# Altium schematic sheet 15_eMMC_FLASH.SchDoc
size A3; SheetNumber: 16; SheetTotal: 22
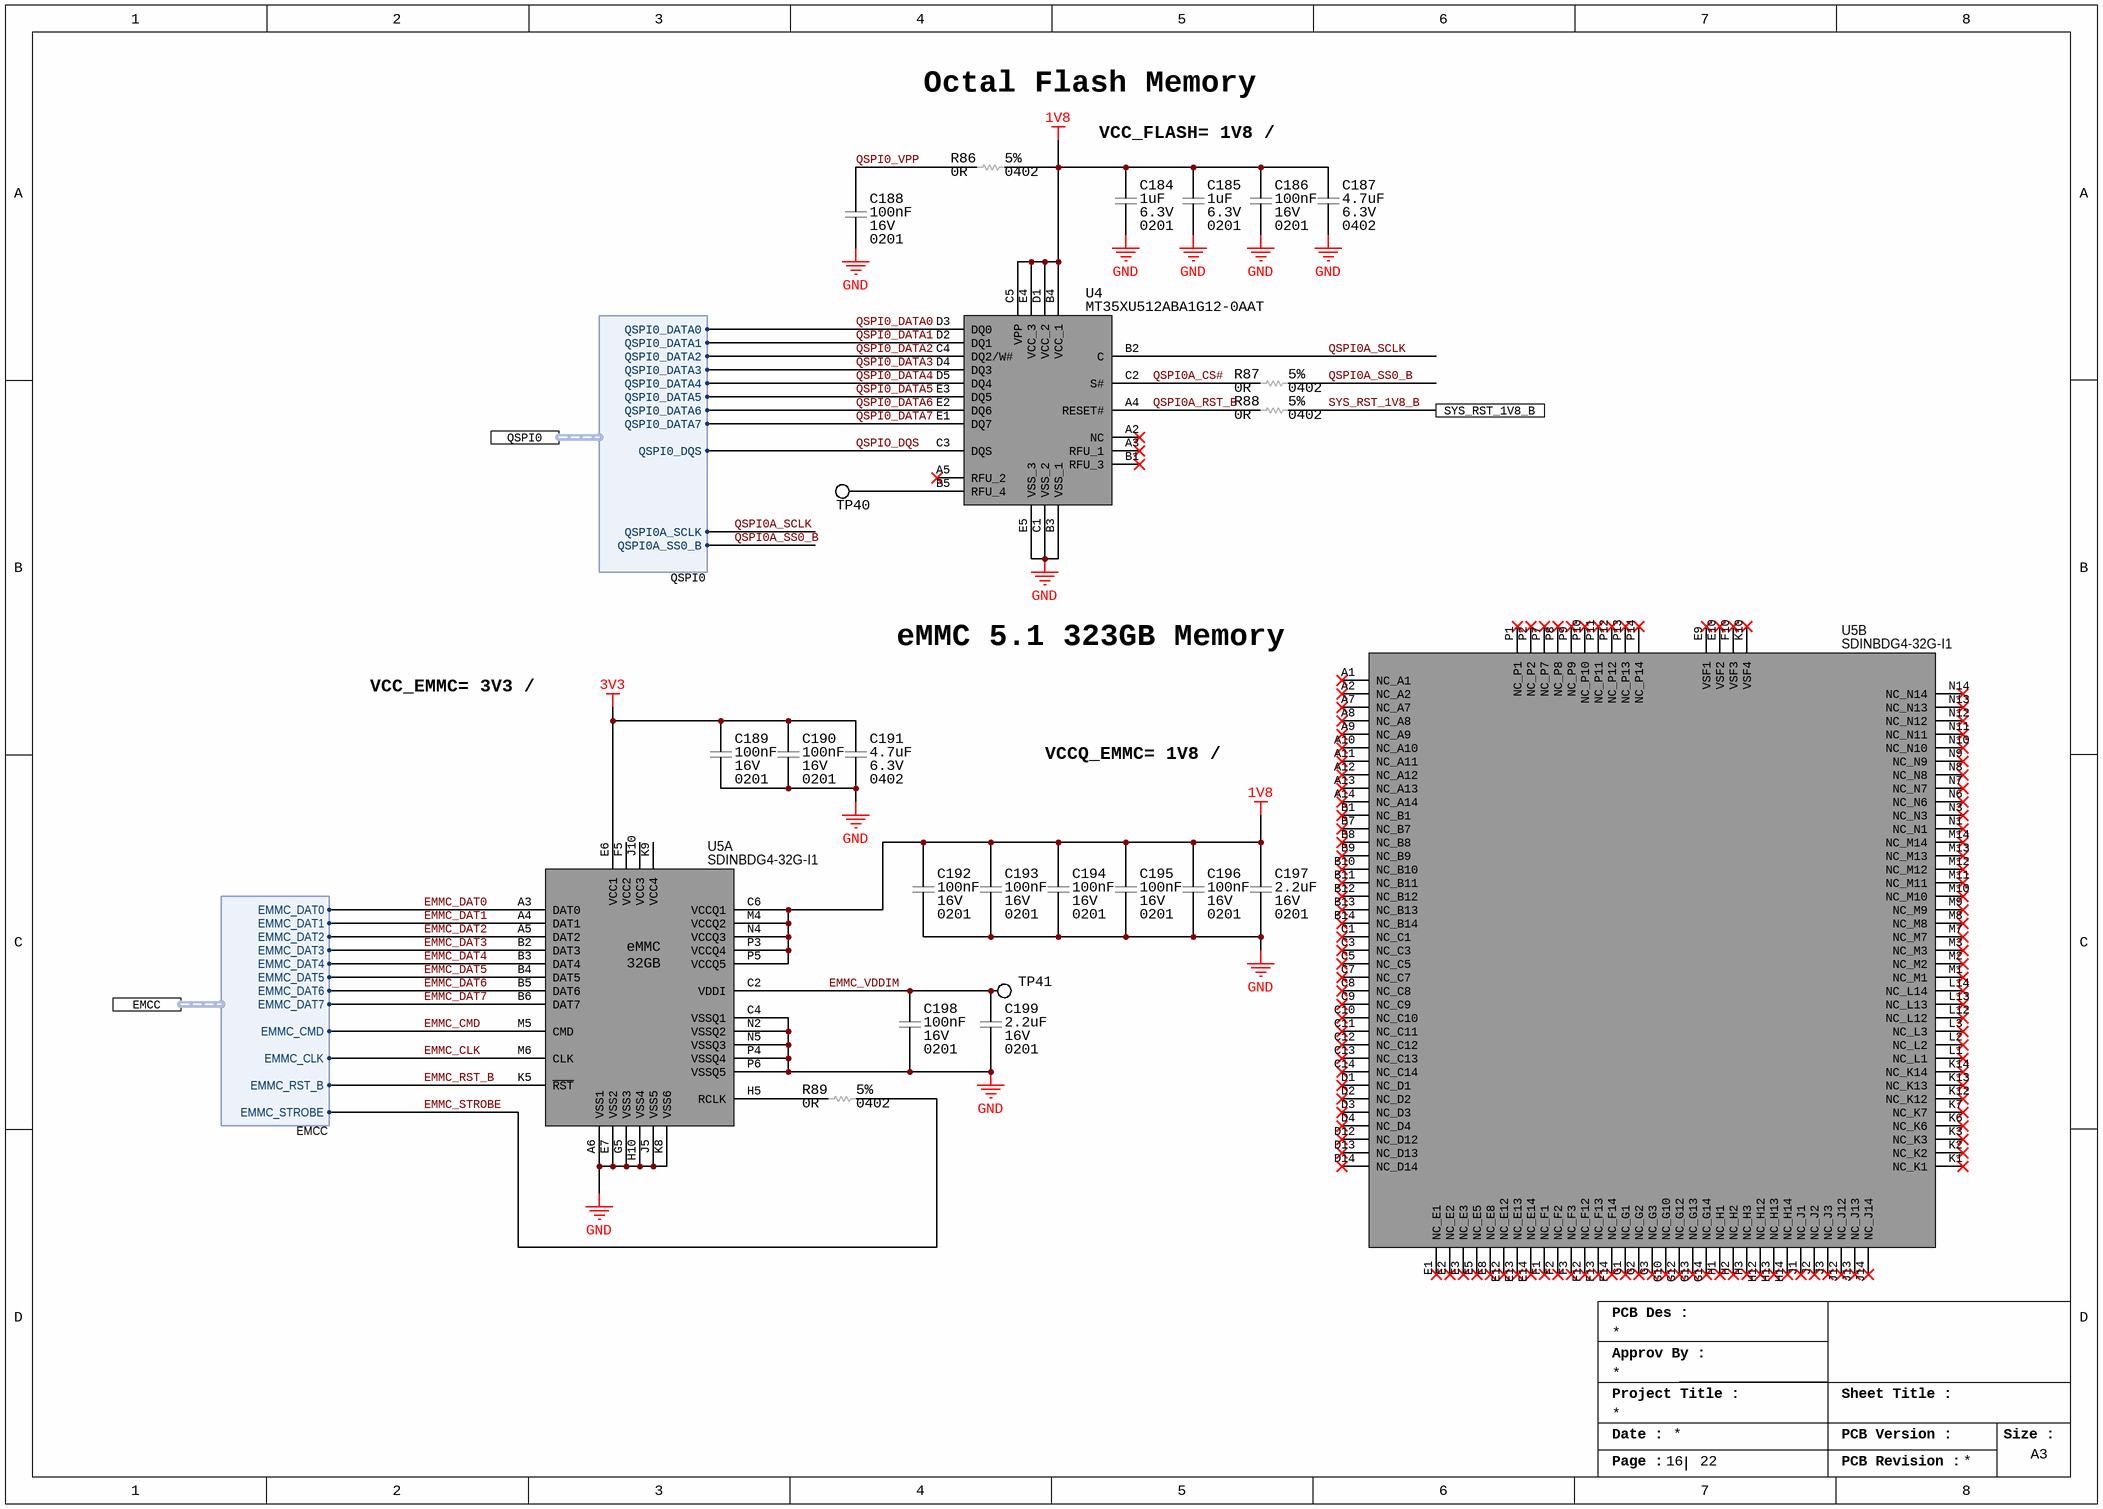
[diagram p0: 15_eMMC_FLASH.SchDoc]

## Parts
C184  Voltage Rating (DC): 6.3V  Capacitance: 1uF  Case/Package: 0201  [CAP_0201_CAPC0603X03N]  (hidden comment: 02016D105MAT2A)
C185  Voltage Rating (DC): 6.3V  Capacitance: 1uF  Case/Package: 0201  [CAP_0201_CAPC0603X03N]  (hidden comment: 02016D105MAT2A)
C186  Voltage Rating: 16V  Capacitance: 100nF  Case/Package: 0201  [CAP_0201_CAPC0603X03N]  (hidden comment: GRM033C71C104KE14D)
C187  Capacitance: 4.7uF  Voltage Rating: 6.3V  Case/Package: 0402  [CAP_0402_CAPC1005X05N]  (hidden comment: C1005X5R0J475M050BC)
C188  Voltage Rating: 16V  Capacitance: 100nF  Case/Package: 0201  [CAP_0201_CAPC0603X03N]  (hidden comment: GRM033C71C104KE14D)
C189  Voltage Rating: 16V  Capacitance: 100nF  Case/Package: 0201  [CAP_0201_CAPC0603X03N]  (hidden comment: GRM033C71C104KE14D)
C190  Voltage Rating: 16V  Capacitance: 100nF  Case/Package: 0201  [CAP_0201_CAPC0603X03N]  (hidden comment: GRM033C71C104KE14D)
C191  Capacitance: 4.7uF  Voltage Rating: 6.3V  Case/Package: 0402  [CAP_0402_CAPC1005X05N]  (hidden comment: C1005X5R0J475M050BC)
C192  Voltage Rating: 16V  Capacitance: 100nF  Case/Package: 0201  [CAP_0201_CAPC0603X03N]  (hidden comment: GRM033C71C104KE14D)
C193  Voltage Rating: 16V  Capacitance: 100nF  Case/Package: 0201  [CAP_0201_CAPC0603X03N]  (hidden comment: GRM033C71C104KE14D)
C194  Voltage Rating: 16V  Capacitance: 100nF  Case/Package: 0201  [CAP_0201_CAPC0603X03N]  (hidden comment: GRM033C71C104KE14D)
C195  Voltage Rating: 16V  Capacitance: 100nF  Case/Package: 0201  [CAP_0201_CAPC0603X03N]  (hidden comment: GRM033C71C104KE14D)
C196  Voltage Rating: 16V  Capacitance: 100nF  Case/Package: 0201  [CAP_0201_CAPC0603X03N]  (hidden comment: GRM033C71C104KE14D)
C197  Capacitance: 2.2uF  Voltage Rating: 16V  Case/Package: 0201  [CAP_0201_CAPC0603X03N]  (hidden comment: GRM035R61C225ME01D)
C198  Voltage Rating: 16V  Capacitance: 100nF  Case/Package: 0201  [CAP_0201_CAPC0603X03N]  (hidden comment: GRM033C71C104KE14D)
C199  Capacitance: 2.2uF  Voltage Rating: 16V  Case/Package: 0201  [CAP_0201_CAPC0603X03N]  (hidden comment: GRM035R61C225ME01D)
R86  Case Code (Imperial): 0402  Tolerance: 5%  Resistance: 0R  [RES_0402_RESC1005X04N]  (hidden comment: ERJ-2GE0R00X)
R87  Case Code (Imperial): 0402  Tolerance: 5%  Resistance: 0R  [RES_0402_RESC1005X04N]  (hidden comment: ERJ-2GE0R00X)
R88  Case Code (Imperial): 0402  Tolerance: 5%  Resistance: 0R  [RES_0402_RESC1005X04N]  (hidden comment: ERJ-2GE0R00X)
R89  Case Code (Imperial): 0402  Tolerance: 5%  Resistance: 0R  [RES_0402_RESC1005X04N]  (hidden comment: ERJ-2GE0R00X)
TP40  NO COMPONENT  [TP_PAD_0.5MM_SMD_ROUND]  (value not drawn)  (no BOM)
TP41  NO COMPONENT  [TP_PAD_0.5MM_SMD_ROUND]  (value not drawn)  (no BOM)
U4  MT35XU512ABA1G12-0AAT  [BGA24C100P5X5_600X800X120]
U5  SDINBDG4-32G-I1  [IC_MEMORY_eMMC]  (parts A,B of 2)

## Ports
EMCC (harness EMCC), QSPI0 (harness QSPI0), SYS_RST_1V8_B

## Harnesses
QSPI0: QSPI0A_SS0_B, QSPI0A_SCLK, QSPI0_DQS, QSPI0_DATA0, QSPI0_DATA1, QSPI0_DATA2, QSPI0_DATA3, QSPI0_DATA4, QSPI0_DATA5, QSPI0_DATA6, QSPI0_DATA7
EMCC: EMMC_CLK, EMMC_CMD, EMMC_DAT0, EMMC_DAT1, EMMC_DAT2, EMMC_DAT3, EMMC_DAT4, EMMC_DAT5, EMMC_DAT6, EMMC_DAT7, EMMC_STROBE, EMMC_RST_B

## Nets
1V8: C184.2 C185.2 C186.2 C187.2 C192.2 C193.2 C194.2 C195.2 C196.2 C197.2 R86.2 U4.B4(VCC_1) U4.C5(VPP) U4.D1(VCC_2) U4.E4(VCC_3) U5.C6(VCCQ1) U5.M4(VCCQ2) U5.N4(VCCQ3) U5.P3(VCCQ4) U5.P5(VCCQ5)
3V3: C189.2 C190.2 C191.2 U5.E6(VCC1)
GND: C184.1 C185.1 C186.1 C187.1 C188.1 C189.1 C190.1 C191.1 C192.1 C193.1 C194.1 C195.1 C196.1 C197.1 C198.1 C199.1 U4.B3(VSS_1) U4.C1(VSS_2) U4.E5(VSS_3) U5.A6(VSS1) U5.C4(VSSQ1) U5.E7(VSS2) U5.G5(VSS3) U5.H10(VSS4) U5.J5(VSS5) U5.K8(VSS6) U5.N2(VSSQ2) U5.N5(VSSQ3) U5.P4(VSSQ4) U5.P6(VSSQ5)
EMMC_CLK: U5.M6(CLK) ; port EMCC.EMMC_CLK
EMMC_CMD: U5.M5(CMD) ; port EMCC.EMMC_CMD
EMMC_DAT0: U5.A3(DAT0) ; port EMCC.EMMC_DAT0
EMMC_DAT1: U5.A4(DAT1) ; port EMCC.EMMC_DAT1
EMMC_DAT2: U5.A5(DAT2) ; port EMCC.EMMC_DAT2
EMMC_DAT3: U5.B2(DAT3) ; port EMCC.EMMC_DAT3
EMMC_DAT4: U5.B3(DAT4) ; port EMCC.EMMC_DAT4
EMMC_DAT5: U5.B4(DAT5) ; port EMCC.EMMC_DAT5
EMMC_DAT6: U5.B5(DAT6) ; port EMCC.EMMC_DAT6
EMMC_DAT7: U5.B6(DAT7) ; port EMCC.EMMC_DAT7
EMMC_RST_B: U5.K5(~{RST}) ; port EMCC.EMMC_RST_B
EMMC_STROBE: R89.2 ; port EMCC.EMMC_STROBE
EMMC_VDDIM: C198.2 C199.2 TP41.1 U5.C2(VDDI)
QSPI0_DATA0: U4.D3(DQ0) ; port QSPI0.QSPI0_DATA0
QSPI0_DATA1: U4.D2(DQ1) ; port QSPI0.QSPI0_DATA1
QSPI0_DATA2: U4.C4(DQ2/W#) ; port QSPI0.QSPI0_DATA2
QSPI0_DATA3: U4.D4(DQ3) ; port QSPI0.QSPI0_DATA3
QSPI0_DATA4: U4.D5(DQ4) ; port QSPI0.QSPI0_DATA4
QSPI0_DATA5: U4.E3(DQ5) ; port QSPI0.QSPI0_DATA5
QSPI0_DATA6: U4.E2(DQ6) ; port QSPI0.QSPI0_DATA6
QSPI0_DATA7: U4.E1(DQ7) ; port QSPI0.QSPI0_DATA7
QSPI0_VPP: C188.2 R86.1
QSPI0A_CS#: R87.1 U4.C2(S#)
QSPI0A_RST_B: R88.1 U4.A4(RESET#)
QSPI0A_SCLK: U4.B2(C) ; port QSPI0.QSPI0A_SCLK
QSPI0A_SS0_B: R87.2 ; port QSPI0.QSPI0A_SS0_B
QSPIO_DQS: U4.C3(DQS) ; port QSPI0.QSPI0_DQS
SYS_RST_1V8_B: R88.2 ; port SYS_RST_1V8_B
NetR89_1: R89.1 U5.H5(RCLK)
NetTP40_1: TP40.1 U4.B5(RFU_4)

Not connected (* = marked no-connect by the designer): U4 A2(NC)* A3(RFU_1)* A5(RFU_2)* B1(RFU_3)*; U5 A1(NC_A1)* A2(NC_A2)* A7(NC_A7)* A8(NC_A8)* A9(NC_A9)* A10(NC_A10)* A11(NC_A11)* A12(NC_A12)* A13(NC_A13)* A14(NC_A14)* B1(NC_B1)* B7(NC_B7)* B8(NC_B8)* B9(NC_B9)* B10(NC_B10)* B11(NC_B11)* B12(NC_B12)* B13(NC_B13)* B14(NC_B14)* C1(NC_C1)* C3(NC_C3)* C5(NC_C5)* C7(NC_C7)* C8(NC_C8)* C9(NC_C9)* C10(NC_C10)* C11(NC_C11)* C12(NC_C12)* C13(NC_C13)* C14(NC_C14)* D1(NC_D1)* D2(NC_D2)* D3(NC_D3)* D4(NC_D4)* D12(NC_D12)* D13(NC_D13)* D14(NC_D14)* E1(NC_E1)* E2(NC_E2)* E3(NC_E3)* E5(NC_E5)* E8(NC_E8)* E9(VSF1)* E10(VSF2)* E12(NC_E12)* E13(NC_E13)* E14(NC_E14)* F1(NC_F1)* F2(NC_F2)* F3(NC_F3)* F5(VCC2) F10(VSF3)* F12(NC_F12)* F13(NC_F13)* F14(NC_F14)* G1(NC_G1)* G2(NC_G2)* G3(NC_G3)* G10(NC_G10)* G12(NC_G12)* G13(NC_G13)* G14(NC_G14)* H1(NC_H1)* H2(NC_H2)* H3(NC_H3)* H12(NC_H12)* H13(NC_H13)* H14(NC_H14)* J1(NC_J1)* J2(NC_J2)* J3(NC_J3)* J10(VCC3) J12(NC_J12)* J13(NC_J13)* J14(NC_J14)* K1(NC_K1)* K2(NC_K2)* K3(NC_K3)* K6(NC_K6)* K7(NC_K7)* K9(VCC4) K10(VSF4)* K12(NC_K12)* K13(NC_K13)* K14(NC_K14)* L1(NC_L1)* L2(NC_L2)* L3(NC_L3)* L12(NC_L12)* L13(NC_L13)* L14(NC_L14)* M1(NC_M1)* M2(NC_M2)* M3(NC_M3)* M7(NC_M7)* M8(NC_M8)* M9(NC_M9)* M10(NC_M10)* M11(NC_M11)* M12(NC_M12)* M13(NC_M13)* M14(NC_M14)* N1(NC_N1)* N3(NC_N3)* N6(NC_N6)* N7(NC_N7)* N8(NC_N8)* N9(NC_N9)* N10(NC_N10)* N11(NC_N11)* N12(NC_N12)* N13(NC_N13)* N14(NC_N14)* P1(NC_P1)* P2(NC_P2)* P7(NC_P7)* P8(NC_P8)* P9(NC_P9)* P10(NC_P10)* P11(NC_P11)* P12(NC_P12)* P13(NC_P13)* P14(NC_P14)*

## Notes on the sheet
- Octal Flash Memory
- VCC_FLASH= 1V8 / 2.5A
- eMMC 5.1 323GB Memory
- VCC_EMMC= 3V3 / 2.5A
- VCCQ_EMMC= 1V8 / 2.5A
- PCB Des :
- Approv By :
- Project Title :
- Sheet Title :
- Date :
- PCB Version :
- Size :
- A3
- Page :
- PCB Revision :
- (in symbol IC_MEMORY_eMMC_SDINBDG4-32G-I1, part A) eMMC / 32GB

## Library data of the parts
C184 C185 = CAP_1UF_6.3V_X5R_0201: 0201 1 uF 6.3 V ±20 % Tolerance X5R Surface Mount Multilayer Ceramic Capacitor; Manufacturer: Kyocera AVX; Tolerance: 20%; Supplier 1: Mouser; Manufacturer Part Number: 02016D105MAT2A; RoHS: Yes; Category: Ceramic Capacitors; Stock 1: 1026413; Pricing 1: 1=0.1, 10=0.028, 50=0.028, 100=0.014, 1000=0.008, 10000=0.006 (USD); Mount: Surface Mount; Number of Pins: 2; Case Code (Metric): 0603; Case Code (Imperial): 0201; Min Operating Temperature: -55°C; Max Operating Temperature: 85°C; Packaging: Cut Tape; Series: -; Voltage Rating: 6.3V; Package Quantity: 1; Length: 0.024inch; Width: 0.012inch; Thickness: 0.013inch; Depth: 0.3mm; Lead Free: Lead Free; RoHS Compliant: Yes; Reach SVHC Compliant: No; ComponentLink1URL: https://datasheet.ciiva.com/6265/cx5r-6265595.pdf?src-supplier=Digi-Key; ComponentLink1Description: https://datasheet.ciiva.com/6265/cx5r-6265595.pdf?src-supplier=Digi-Key; ComponentLink2URL: https://datasheet.ciiva.com/1123/1666675-1123122.pdf?src-supplier=Element14; ComponentLink2Description: https://datasheet.ciiva.com/1123/1666675-1123122.pdf?src-supplier=Element14; ComponentLink3URL: https://datasheet.ciiva.com/14891/cx5r-14891029.pdf?src-supplier=Digi-Key; ComponentLink3Description: https://datasheet.ciiva.com/14891/cx5r-14891029.pdf?src-supplier=Digi-Key; ComponentLink4URL: https://datasheet.ciiva.com/7614/cx5r-7614682.pdf?src-supplier=Digi-Key; ComponentLink4Description: https://datasheet.ciiva.com/7614/cx5r-7614682.pdf?src-supplier=Digi-Key; ComponentLink5URL: https://datasheet.ciiva.com/14891/cx5r-14891030.pdf?src-supplier=Digi-Key; ComponentLink5Description: https://datasheet.ciiva.com/14891/cx5r-14891030.pdf?src-supplier=Digi-Key; Supplier Part Number 1: 581-02016D105MAT2A; Dielectric: X5R
C186 C188-C190 C192-C196 C198 = CAP_100nF_16V_X7S_0201: Multilayer Ceramic Capacitor, 0.1 uF, 16 V, ± 10%, X7S, 0201 [0603 Metric]; Manufacturer: Murata; Material: 4241ConductorMaterial; Supplier 1: Digikey; Manufacturer Part Number: GRM033C71C104KE14D; RoHS: Yes; Category: Ceramic Capacitors; Stock 1: 1786846; Pricing 1: 1=0.1, 10=0.032, 50=0.0186, 100=0.0144, 500=0.01082, 1000=0.0085, 2500=0.00772, 5000=0.00711 (USD); Mount: Surface Mount; Case Code (Metric): 0603; Case Code (Imperial): 0201; Weight: 1.2E-05oz; Min Operating Temperature: -55°C; Max Operating Temperature: 125°C; Packaging: Tape and Reel; Tolerance: 10%; Dielectric: X7S; Termination: SMD/SMT; Voltage Rating (DC): 16V; Package Quantity: 15000; Series: GRM; Length: 0.024inch; Width: 0.012inch; Height: 0.3mm; Thickness: 0.013inch; RoHS Compliant: Yes; ComponentLink1URL: http://www.farnell.com/datasheets/2867828.pdf?src-supplier=Farnell; ComponentLink1Description: http://www.farnell.com/datasheets/2867828.pdf?src-supplier=Farnell; ComponentLink2URL: http://www.mouser.com/ds/2/281/c02e-2905.pdf?src-supplier=Mouser; ComponentLink2Description: http://www.mouser.com/ds/2/281/c02e-2905.pdf?src-supplier=Mouser; ComponentLink3URL: https://search.murata.co.jp/Ceramy/image/img/A01X/G101/ENG/GRM033C71C104KE14-01.pdf?src-supplier=Digikey; ComponentLink3Description: https://search.murata.co.jp/Ceramy/image/img/A01X/G101/ENG/GRM033C71C104KE14-01.pdf?src-supplier=Digikey; ComponentLink4URL: http://www.farnell.com/datasheets/2867828.pdf?src-supplier=Element14; ComponentLink4Description: http://www.farnell.com/datasheets/2867828.pdf?src-supplier=Element14; ComponentLink5URL: https://datasheet.octopart.com/GRM033C71C104KE14D-Murata-datasheet-22122223.pdf?src-supplier=Future+Electronics; ComponentLink5Description: https://datasheet.octopart.com/GRM033C71C104KE14D-Murata-datasheet-22122223.pdf?src-supplier=Future+Electronics; ComponentLink6URL: http://www.farnell.com/datasheets/2867828.pdf?src-supplier=Newark; ComponentLink6Description: http://www.farnell.com/datasheets/2867828.pdf?src-supplier=Newark; Supplier Part Number 1: 490-10387-6-ND
C187 C191 = CAP_4.7UF_6.3V_X5R_0402: Multilayer Ceramic Capacitor, 4.7 uF, 6.3 V, ± 20%, X5R, 0402 [1005 Metric]; Manufacturer: TDK; Material: 4241ConductorMaterial; Dissipation Factor: 10%; Supplier 1: Digi-Key; Manufacturer Part Number: C1005X5R0J475M050BC; RoHS: Yes; Category: Ceramic Capacitors; Stock 1: 799722; Pricing 1: 1=0.35, 10=0.233, 50=0.1716, 100=0.1396, 500=0.11024, 1000=0.0931, 2500=0.0882, 5000=0.0833 (USD); Mount: Surface Mount; Dielectric Material: Ceramic; Case Code (Metric): 1005; Case Code (Imperial): 0402; Weight: 2.3E-05oz; Min Operating Temperature: -55°C; Max Operating Temperature: 85°C; Packaging: Tape and Reel; Tolerance: 20%; Voltage Rating (DC): 6.3V; Dielectric: X5R; Package Quantity: 1; Termination: SMD/SMT; Voltage: 6.3V; Series: C; Construction: Flat; Length: 1mm; Width: 0.02inch; Height: 0.5mm; Depth: 0.5mm; Thickness: 0.026inch; Lead Free: Lead Free; Reach SVHC Compliant: No; RoHS Compliant: Yes; ComponentLink1URL: https://datasheet.ciiva.com/24216/c1005x5r0j475m050bc-264348-24216583.pdf?src-supplier=Mouser; ComponentLink1Description: https://datasheet.ciiva.com/24216/c1005x5r0j475m050bc-264348-24216583.pdf?src-supplier=Mouser; ComponentLink2URL: https://datasheet.ciiva.com/5962/639999-5962567.pdf?src-supplier=Farnell; ComponentLink2Description: https://datasheet.ciiva.com/5962/639999-5962567.pdf?src-supplier=Farnell; ComponentLink3URL: https://datasheet.ciiva.com/22648/1796654-22648701.pdf?src-supplier=Element14; ComponentLink3Description: https://datasheet.ciiva.com/22648/1796654-22648701.pdf?src-supplier=Element14; ComponentLink4URL: https://datasheet.ciiva.com/22749/1744655-22749711.pdf?src-supplier=Element14; ComponentLink4Description: https://datasheet.ciiva.com/22749/1744655-22749711.pdf?src-supplier=Element14; ComponentLink5URL: https://datasheet.ciiva.com/7770/639999-7770124.pdf?src-supplier=Element14; ComponentLink5Description: https://datasheet.ciiva.com/7770/639999-7770124.pdf?src-supplier=Element14; ComponentLink6URL: https://datasheet.ciiva.com/6289/tdkmlcccaprange-6289886.pdf?src-supplier=Digi-Key; ComponentLink6Description: https://datasheet.ciiva.com/6289/tdkmlcccaprange-6289886.pdf?src-supplier=Digi-Key; ComponentLink7URL: https://datasheet.ciiva.com/6289/tdkmlcccaprange-6289895.pdf?src-supplier=Digi-Key; ComponentLink7Description: https://datasheet.ciiva.com/6289/tdkmlcccaprange-6289895.pdf?src-supplier=Digi-Key; ComponentLink8URL: https://datasheet.ciiva.com/16425/e412-c-16425670.pdf?src-supplier=Future+Electronics; ComponentLink8Description: https://datasheet.ciiva.com/16425/e412-c-16425670.pdf?src-supplier=Future+Electronics; Supplier Part Number 1: 445-7395-1-ND
C197 C199 = CAP_2.2uF_16V_X5R_0201: General Up to 85C Reflow soldering; Manufacturer: Murata; Material: Ceramic; Dielectric: X5R; Tolerance: 20%; Supplier 1: Digikey; Manufacturer Part Number: GRM035R61C225ME01D; RoHS: No; Category: Ceramic Capacitors; Stock 1: 18674; Pricing 1: 1=0.36, 10=0.233, 50=0.1636, 100=0.1321, 500=0.09814, 1000=0.08587, 2500=0.08178, 5000=0.07565 (USD); Min Operating Temperature: -55°C; Max Operating Temperature: 85°C; Voltage Rating (DC): 16V; Length: 600um; Width: 300um; Height: 550um; Thickness: 500um; RoHS Compliant: Yes; ComponentLink1URL: https://datasheet.octopart.com/GRM035R61C225ME01D-Murata-datasheet-165579666.pdf?src-supplier=TME; ComponentLink1Description: https://datasheet.octopart.com/GRM035R61C225ME01D-Murata-datasheet-165579666.pdf?src-supplier=TME; Supplier Part Number 1: 490-GRM035R61C225ME01DCT-ND
R86-R89 = RES_0R_5%_100mW_0402: SMD Chip Resistor, Jumper, 0 ohm, 100 mW, 0402 [1005 Metric], Thick Film, General Purpose; Manufacturer: Panasonic; Power Rating: 100mW; Voltage Rating: 50V; Temperature Coefficient: 600ppm/°C; Supplier 1: Mouser; Manufacturer Part Number: ERJ-2GE0R00X; RoHS: Yes; Category: Chip SMD Resistors; Stock 1: 10989354; Pricing 1: 1=0.1, 10=0.013, 50=0.013, 100=0.006, 1000=0.004, 2500=0.003, 10000=0.003 (USD); Mount: Surface Mount; Case/Package: 0402; Contact Plating: Tin; Case Code (Metric): 1005; Size Code: 0402; Min Operating Temperature: -55°C; Max Operating Temperature: 155°C; Resistor Type: Thick Film; Packaging: Cut Tape; Package Quantity: 10000; Number of Terminations: 2; Termination: SMD/SMT; Max Power Dissipation: 100mW; Voltage Rating (DC): 50V; Features: Automotive AEC-Q200; Series: ERJ; Construction: Rectangular; Technology: THICK FILM; Length: 1mm; Width: 0.5mm; Height: 0.35mm; Depth: 0.5mm; Ratings: AEC-Q200; Radiation Hardening: No; Reach SVHC Compliant: No; Military Standard: Not; Lead Free: Lead Free; RoHS Compliant: Yes; ComponentLink1URL: https://datasheet.ciiva.com/11821/0900766b80f806dd-11821176.pdf?src-supplier=Rs; ComponentLink1Description: https://datasheet.ciiva.com/11821/0900766b80f806dd-11821176.pdf?src-supplier=Rs; ComponentLink2URL: https://datasheet.ciiva.com/43460/1678796-43460347.pdf?src-supplier=Farnell; ComponentLink2Description: https://datasheet.ciiva.com/43460/1678796-43460347.pdf?src-supplier=Farnell; ComponentLink3URL: https://datasheet.ciiva.com/46389/1678796-46389518.pdf?src-supplier=Element14; ComponentLink3Description: https://datasheet.ciiva.com/46389/1678796-46389518.pdf?src-supplier=Element14; ComponentLink4URL: https://datasheet.ciiva.com/5959/1678796-5959692.pdf?src-supplier=Farnell; ComponentLink4Description: https://datasheet.ciiva.com/5959/1678796-5959692.pdf?src-supplier=Farnell; ComponentLink5URL: https://datasheet.ciiva.com/28695/1678796-28695758.pdf?src-supplier=Element14; ComponentLink5Description: https://datasheet.ciiva.com/28695/1678796-28695758.pdf?src-supplier=Element14; ComponentLink6URL: https://datasheet.ciiva.com/16783/70260739-16783734.pdf?src-supplier=Allied+Electronics; ComponentLink6Description: https://datasheet.ciiva.com/16783/70260739-16783734.pdf?src-supplier=Allied+Electronics; ComponentLink7URL: https://datasheet.ciiva.com/16778/70260739-16778335.pdf?src-supplier=Allied+Electronics; ComponentLink7Description: https://datasheet.ciiva.com/16778/70260739-16778335.pdf?src-supplier=Allied+Electronics; ComponentLink8URL: https://datasheet.ciiva.com/48531/aoa0000ce1-48531077.pdf?src-supplier=Avnet; ComponentLink8Description: https://datasheet.ciiva.com/48531/aoa0000ce1-48531077.pdf?src-supplier=Avnet; ComponentLink9URL: https://datasheet.ciiva.com/30097/4aoa0000ce1-30097116.pdf?src-supplier=Onlinecomponents.com; ComponentLink9Description: https://datasheet.ciiva.com/30097/4aoa0000ce1-30097116.pdf?src-supplier=Onlinecomponents.com; Supplier Part Number 1: 667-ERJ-2GE0R00X
TP40 TP41 = TP_PAD_SMD_SMALL: Test Point, SMD pad, round, 1.5mm, 1.6mm, 3mm diameter
U4 = IC_MEMORY_FLASH_512Mb_MT35XU512ABA1G12-0AAT: NOR Flash, NOR Flash for Automotive, 512Mb, 1.7V-2.0V, 200 MHz, 24-ball T-PBGA, RoHS; Manufacturer: Micron Technology; Memory Type: Non-Volatile,FLASH; Frequency: 200MHz; Supplier 1: Digikey; Manufacturer Part Number: MT35XU512ABA1G12-0AAT; RoHS: Yes; Category: Flash; Stock 1: 997; Pricing 1: 1=9.41, 10=8.741, 25=8.4728, 50=8.27, 100=8.0685, 250=7.80496, 500=7.60874, 1122=7.38411 (USD); Mount: Surface Mount; Case/Package: TBGA; Min Operating Temperature: -40°C; Max Operating Temperature: 105°C; Packaging: Bulk; Memory Size: 512Mb; Series: Xccela™ - MT35X; ComponentLink1URL: https://datasheet.octopart.com/MT35XU512ABA1G12-0AAT-Micron-datasheet-141417480.pdf?src-supplier=Farnell; ComponentLink1Description: https://datasheet.octopart.com/MT35XU512ABA1G12-0AAT-Micron-datasheet-141417480.pdf?src-supplier=Farnell; ComponentLink2URL: https://datasheet.octopart.com/MT35XU512ABA1G12-0AAT-Micron-datasheet-141417480.pdf?src-supplier=Element14; ComponentLink2Description: https://datasheet.octopart.com/MT35XU512ABA1G12-0AAT-Micron-datasheet-141417480.pdf?src-supplier=Element14; Supplier Part Number 1: MT35XU512ABA1G12-0AAT-ND
U5 = IC_MEMORY_eMMC_SDINBDG4-32G-I1: Inand 7250 32GB Industrial Wide Temp -25C+85C EMMC5.1 HS400; Manufacturer: SanDisk; Supplier 1: Mouser; Manufacturer Part Number: SDINBDG4-32G-I1; RoHS: No; Category: Uncategorized; Stock 1: 1018; Pricing 1: 1=26.46, 10=24.64, 50=23.78, 100=20.87, 1000=20.16, 10000=20.16 (USD); RoHS Compliant: No; Supplier Part Number 1: 467-SDINBDG4-32G-I1